# Altium schematic sheet Sheet1.SchDoc
size A
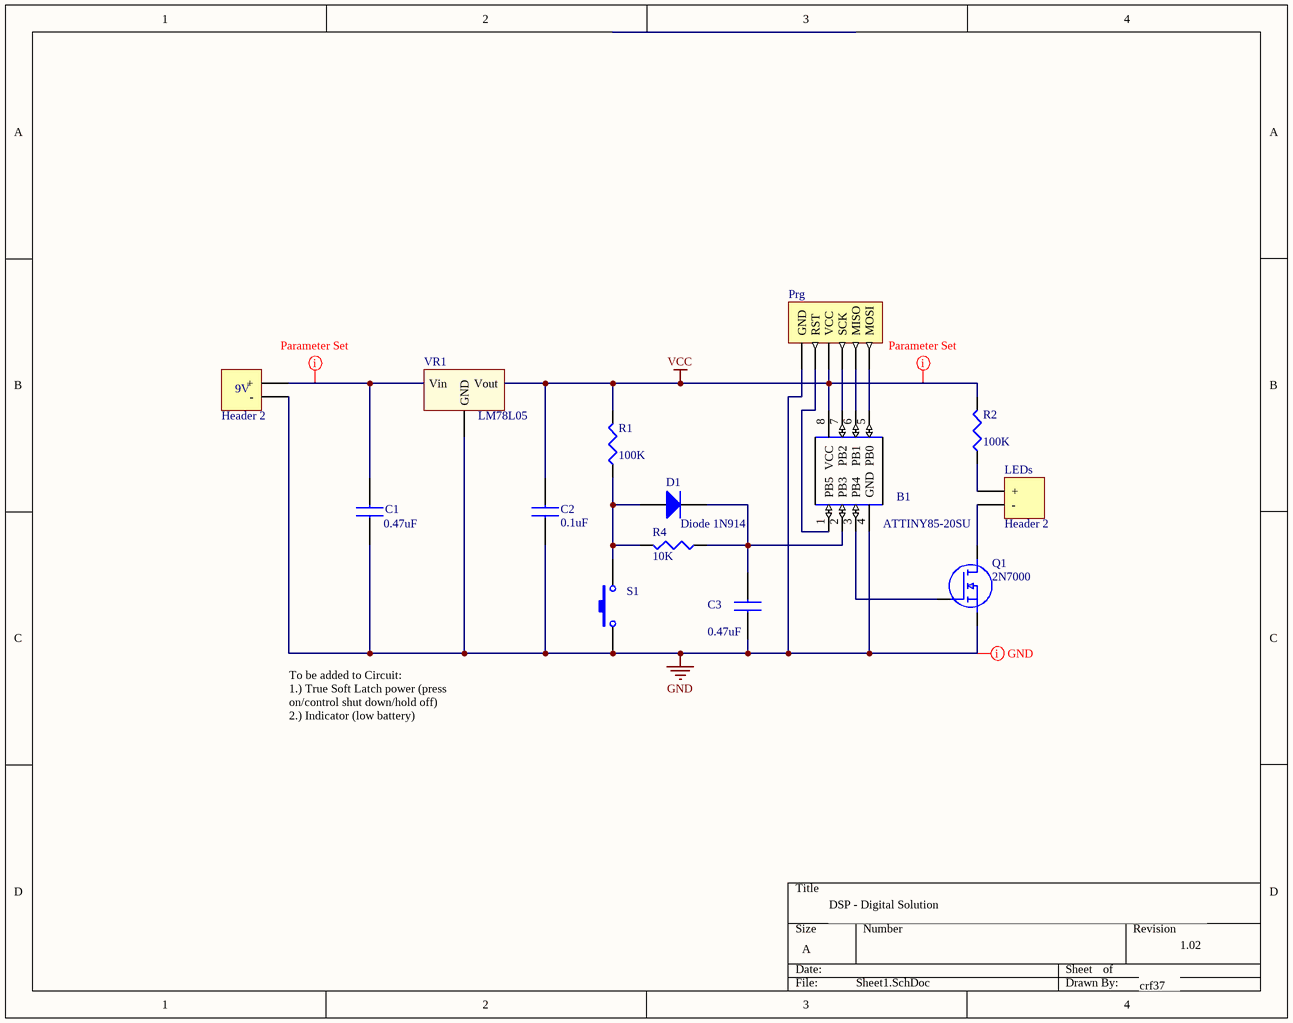
[diagram p0: Sheet1.SchDoc]

## Parts
9V  Header 2  [HDR1X2]
B1  ATTINY85-20SU  [SOT127P798X216-8N]
C1  0.47uF  [CAPC2012X145N]
C2  0.1uF  [CAPC2012X145N]
C3  0.47uF  [CAPC2012X145N]
D1  Diode 1N914  [DO-35]
LEDs  Header 2  [HDR1X2]
Prg  Header 6  [HDR1X6]  (value not drawn)
Q1  2N7000  [TO-92_(TO-226)]
R1  value 100K  [J1-0603]  (hidden comment: Res3)
R2  value 100K  [J1-0603]  (hidden comment: Res3)
R4  value 10K  [J1-0603]  (hidden comment: Res3)
S1  SW-PB  [SPST-2]  (value not drawn)
VR1  LM78L05  [LP0003A]

## Nets
GND: 9V.1(-) B1.4(GND) C1.1 C2.1 C3.1 Prg.1(GND) Q1.1(S) S1.1 VR1.2(GND)
VCC: B1.8(VCC) C2.2 Prg.3(VCC) R1.2 R2.2 VR1.1(Vout)
Net9V_2: 9V.2(+) C1.2 VR1.3(Vin)
NetB1_1: B1.1(PB5) Prg.2(RST)
NetB1_2: B1.2(PB3) C3.2 D1.2(K) R4.1
NetB1_3: B1.3(PB4) Q1.2(G)
NetB1_5: B1.5(PB0) Prg.6(MOSI)
NetB1_6: B1.6(PB1) Prg.5(MISO)
NetB1_7: B1.7(PB2) Prg.4(SCK)
NetD1_1: D1.1(A) R1.1 R4.2 S1.2
NetLEDs_1: LEDs.1(+) R2.2
NetLEDs_2: LEDs.2(-) Q1.3(D)

## Layout directives
rule Width Constraint [Pref Width = 20mil    Min Width = 10mil    Max Width = 20mil]: GND
rule Width Constraint [Pref Width = 20mil    Min Width = 20mil    Max Width = 20mil]; net class Power: Net9V_2, VCC

## Notes on the sheet
- To be added to Circuit:
  1.) True Soft Latch power (press on/control shut down/hold off)
  2.) Indicator (low battery)
- DSP - Digital Solution
- 1.02
- crf37

## Library data of the parts
9V LEDs = Header 2: Header, 2-Pin; LatestRevisionDate: 17-Jul-2002; LatestRevisionNote: Re-released for DXP Platform.; Publisher: Altium Limited
B1 = ATTINY85-20SU: MICROCHIP - ATTINY85-20SU - MICROCONTROLLER MCU, 8 BIT, ATTINY, 20MHZ, SOIC-8; Geometry.Height: 2.16mm; Manufacturer_Name: Microchip; Manufacturer_Part_Number: ATTINY85-20SU; RS Part Number: 1331674; RS Price/Stock: http://uk.rs-online.com/web/p/products/1331674; Arrow Part Number: ATTINY85-20SU; Arrow Price/Stock: https://www.arrow.com/en/products/attiny85-20su/microchip-technology; Datasheet Link: https://componentsearchengine.com/Datasheets/2/ATTINY85-20SU.pdf
C1-C3 = GRM21BR71H474KA88L: Multilayer Ceramic Capacitors MLCC - SMD/SMT 0805 0.47uF 50volts X7R 10%; Manufacturer_Name: Murata Electronics; Geometry.Height: 1.45mm; Manufacturer_Part_Number: GRM21BR71H474KA88L; RS Part Number: 7236118P; RS Price/Stock: http://uk.rs-online.com/web/p/products/7236118P; Arrow Part Number: GRM21BR71H474KA88L; Arrow Price/Stock: https://www.arrow.com/en/products/grm21br71h474ka88l/murata-manufacturing; Datasheet Link: http://www.murata.com/~/media/webrenewal/support/library/catalog/products/capacitor/mlcc/c02e.pdf
D1 = Diode 1N914: High Conductance Fast Diode; Published: 8-Jun-2000; LatestRevisionDate: 17-Jul-2002; LatestRevisionNote: Re-released for DXP Platform.; DatasheetVersion: 1997; PackageReference: DO-35; Publisher: Altium Limited; PackageDescription: Diode, Axial; Body 3.8 x 1.9 mm (LxDia. max), Lead Dia. 0.53 mm (max); Code_JEDEC: DO-204-AH; ComponentLink1Description: Manufacturer Link; ComponentLink1URL: http://www.fairchildsemi.com/; ComponentLink2Description: Datasheet; ComponentLink2URL: http://www.fairchildsemi.com/ds/1N%2F1N4448.pdf
Prg = Header 6: Header, 6-Pin; LatestRevisionDate: 17-Jul-2002; LatestRevisionNote: Re-released for DXP Platform.; Publisher: Altium Limited
Q1 = 2N7000: N-channel MOSFET,2N7000 0.2A 60V; Manufacturer_Name: ON Semiconductor; Manufacturer_Part_Number: 2N7000; RS Part Number: 1698553; RS Price/Stock: http://uk.rs-online.com/web/p/products/1698553; Arrow Part Number: 2N7000; Arrow Price/Stock: https://www.arrow.com/en/products/2n7000/on-semiconductor; Datasheet Link: http://www.onsemi.com/pub/Collateral/NDS7002A-D.PDF
R1 R2 R4 = Res3: Resistor; Published: 8-Jun-2000; LatestRevisionDate: 29-May-2009; LatestRevisionNote: IPC-7351 Footprint Added.; PackageReference: J1-0603; Publisher: Altium Limited; PackageDescription: Chip Resistor
S1 = SW-PB: Switch; Published: 24-Mar-1999; LatestRevisionDate: 17-Jul-2002; LatestRevisionNote: Re-released for DXP Platform.; PackageReference: SPST-2; Publisher: Altium Limited; PackageDescription: Switch; 2 Leads
VR1 = LM78L05: Voltage regulator,LM78L05ACZ 5V LM78L05ACZ/NOPB, Voltage Regulator, 0.1A 5 V,; Manufacturer_Name: Texas Instruments; Manufacturer_Part_Number: LM78L05ACZ/NOPB; RS Part Number: 5359975P; RS Price/Stock: http://uk.rs-online.com/web/p/products/5359975P; Arrow Part Number: LM78L05ACZ/NOPB; Arrow Price/Stock: https://www.arrow.com/en/products/lm78l05acznopb/texas-instruments; Datasheet Link: http://www.ti.com/lit/ds/symlink/lm78l.pdf